# EAGLE schematic mainboard.pa1 (EAGLE 4.11)
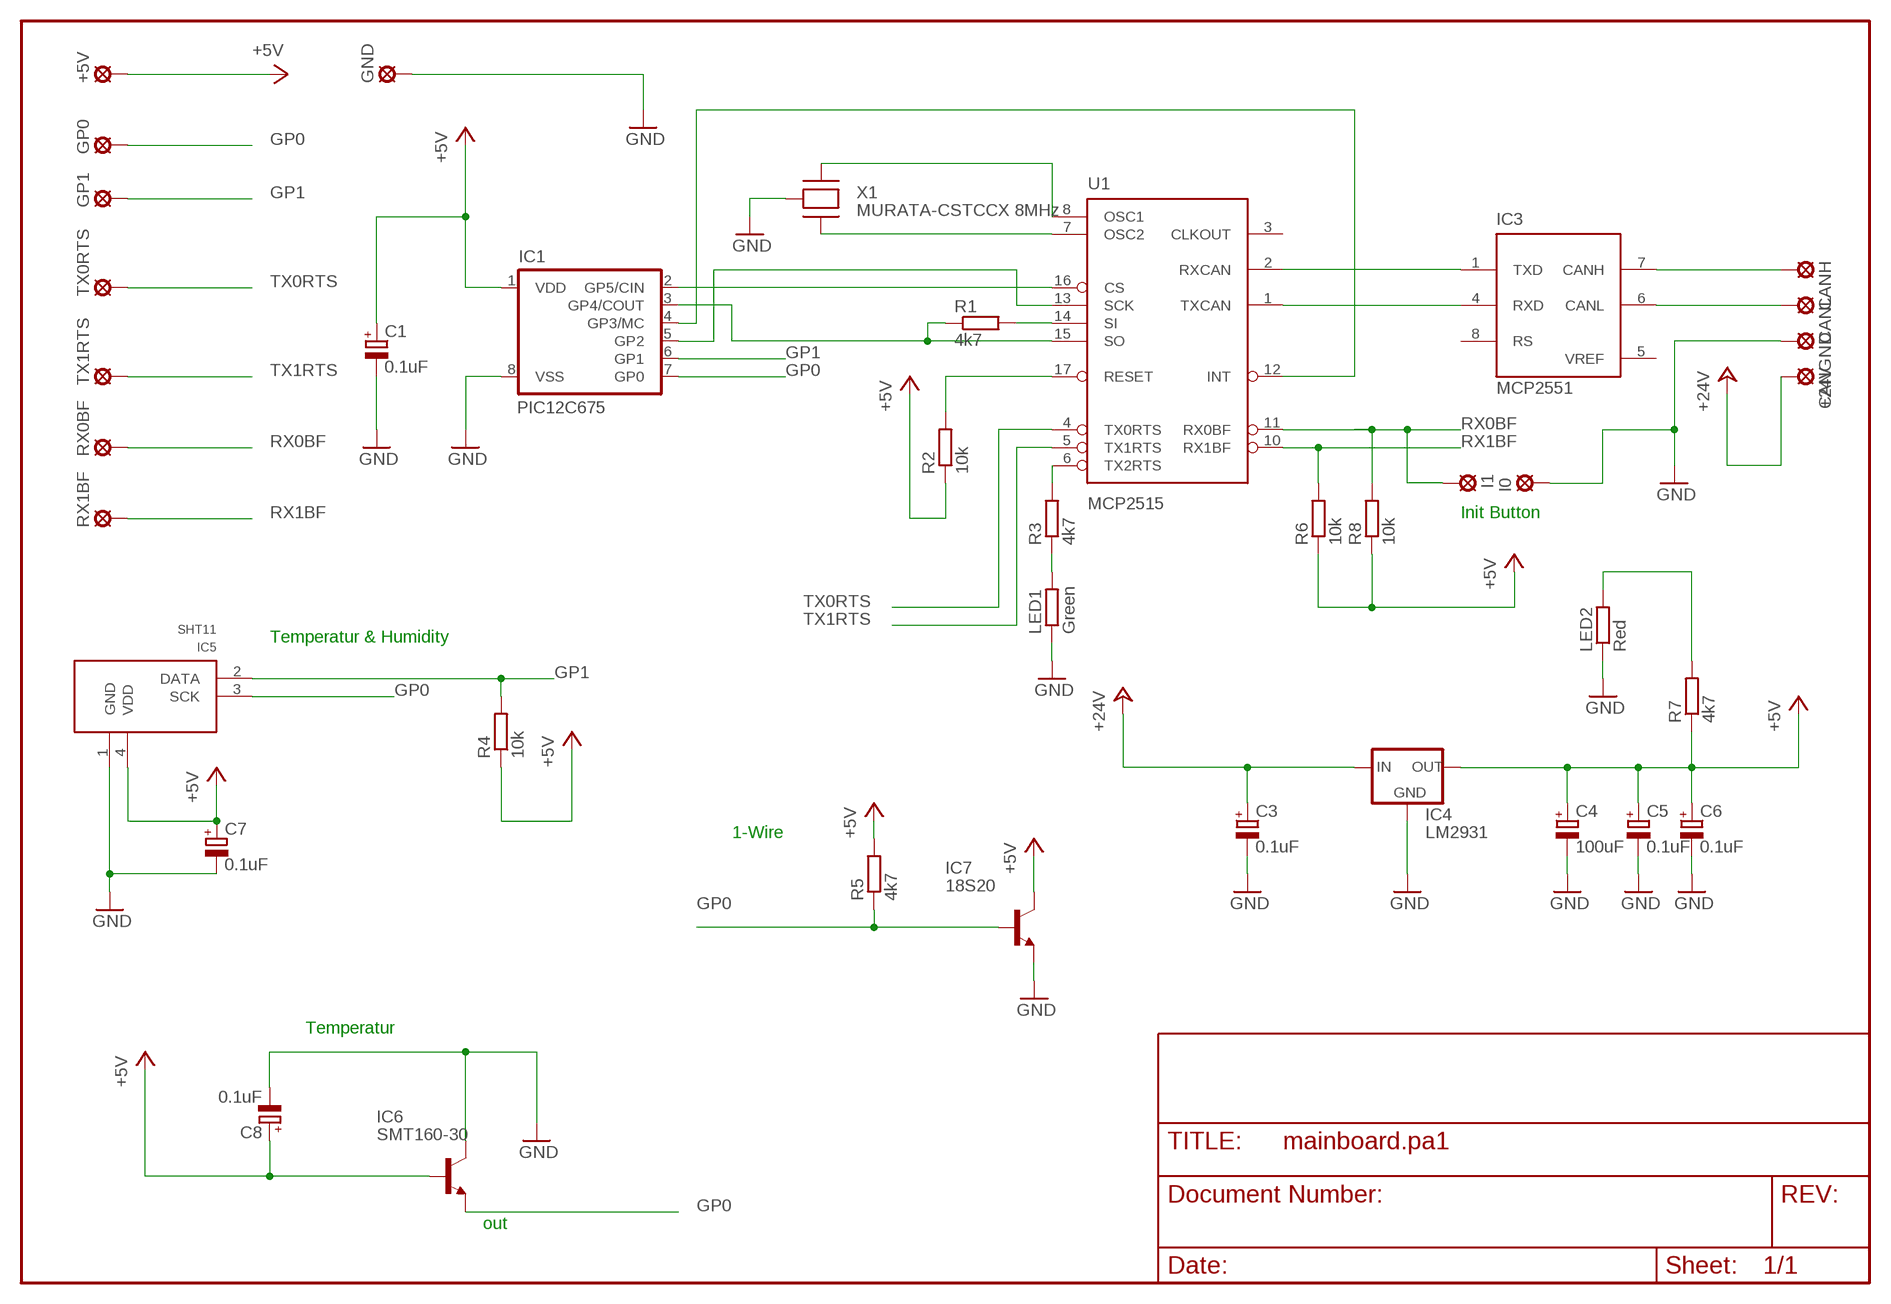
[diagram p0: schematic, sheet 1]

## Parts
+5V  SE14  [SE14]
+24V  SE14  [SE14]
C1  0.1uF  CPOL-EUCT3216  [CT3216]
C3  0.1uF  CPOL-EUCT3216  [CT3216]
C4  100uF  CPOL-EUCT7343  [CT7343]
C5  0.1uF  CPOL-EUCT3216  [CT3216]
C6  0.1uF  CPOL-EUCT3216  [CT3216]
C7  0.1uF  CPOL-EUCT3216  [CT3216]
C8  0.1uF  CPOL-EUCT3216  [CT3216]
CANGND  SE14  [SE14]
CANH  SE14  [SE14]
CANL  SE14  [SE14]
GND  SE14  [SE14]
GP0  SE14  [SE14]
GP1  SE14  [SE14]
I0  SE14  [SE14]
I1  SE14  [SE14]
IC1  PIC12C675  PIC12C672SM  [SO-08M]
IC3  MCP2551  MCP2551SN  [SO-08]
IC4  LM2931  78LXX  [78LXX]
IC5  SHT11  SHT1X  [SHT1X]
IC6  SMT160-30  BC547  [TO92]
IC7  18S20  BC547  [TO92]
LED1  Green  R-EU_R1206  [R1206]
LED2  Red  R-EU_R1206  [R1206]
R1  4k7  R-EU_R0805  [R0805]
R2  10k  R-EU_R0805  [R0805]
R3  4k7  R-EU_R0805  [R0805]
R4  10k  R-EU_R0805  [R0805]
R5  4k7  R-EU_R0805  [R0805]
R6  10k  R-EU_R0805  [R0805]
R7  4k7  R-EU_R0805  [R0805]
R8  10k  R-EU_R0805  [R0805]
RX0BF  SE14  [SE14]
RX1BF  SE14  [SE14]
TX0RTS  SE14  [SE14]
TX1RTS  SE14  [SE14]
U1  MCP2515  MCP2510SO  [SO-18W]
X1  MURATA-CSTCCX 8MHz  MURATA-CSTCCX  [RESONATOR-MURATA-CSTCCX]

## Nets
+5V: +5V.MP C1.+ C4.+ C5.+ C6.+ C7.+ C8.+ IC1.1(VDD) IC4.OUT IC5.4(VDD) IC6.2(B) IC7.3(C) R2.1 R4.1 R5.2 R6.1 R7.1 R8.1
+24V: +24V.MP C3.+ IC4.IN
GND: C1.- C3.- C4.- C5.- C6.- C7.- C8.- CANGND.MP GND.MP I0.MP IC1.8(VSS) IC4.GND IC5.1(GND) IC6.3(C) IC7.1(E) LED1.1 LED2.1 X1.3(GND)
GP0: GP0.MP IC1.7(GP0) IC5.3(SCK) IC6.1(E) IC7.2(B) R5.1
GP1: GP1.MP IC1.6(GP1) IC5.2(DATA) R4.2
GP2: IC1.5(GP2) U1.13(SCK)
GP3: IC1.4(GP3/MC) U1.12(INT)
GP4: IC1.3(GP4/COUT) R1.1 U1.15(SO)
GP5: IC1.2(GP5/CIN) U1.16(CS)
N$1: IC3.1(TXD) U1.2(RXCAN)
N$2: IC3.4(RXD) U1.1(TXCAN)
N$3: R2.2 U1.17(RESET)
N$4: CANH.MP IC3.7(CANH)
N$5: CANL.MP IC3.6(CANL)
N$7: R1.2 U1.14(SI)
N$10: LED1.2 R3.1
N$12: LED2.2 R7.2
OSC1: U1.8(OSC1) X1.2(XTIN)
OSC2: U1.7(OSC2) X1.1(XTOUT)
RX0BF: I1.MP R8.2 RX0BF.MP U1.11(RX0BF)
RX1BF: R6.2 RX1BF.MP U1.10(RX1BF)
TX0RTS: TX0RTS.MP U1.4(TX0RTS)
TX1RTS: TX1RTS.MP U1.5(TX1RTS)
TX2RTS: R3.2 U1.6(TX2RTS)
Unconnected: IC3.8(RS) U1.3(CLKOUT)

## Notes on the sheet
- Init Button
- Temperatur & Humidity
- 1-Wire
- Temperatur
- out

## Power pins joined to a net without a drawn wire
VDD: IC3.3(VDD) U1.18(VDD)
VREF: IC3.5(VREF)
VSS: IC3.2(VSS) U1.9(VSS)

## Library data of the parts
+5V +24V CANGND CANH CANL GND GP0 GP1 I0 I1 RX0BF RX1BF TX0RTS TX1RTS = solpad:SE14: SOLDER PAD E1553, drill 1,4mm, distributor Buerklin, 07F820
C1 C3-C8 = rcl:CPOL-EU: POLARIZED CAPACITOR, European symbol
IC1 = microchip:PIC12C*?: MICROCONTROLLER
IC3 = microchip_can:MCP2551: High Speed CAN tranceiver
IC4 = v-reg:78LXX: VOLTAGE REGULATOR
IC5 = eurosource_ftdi:SHT1X
IC6 IC7 = transistor-npn:BC547*: NPN Transistor
LED1 LED2 R1-R8 = rcl:R-EU_: RESISTOR, European symbol
U1 = microchip_can:MCP2510
X1 = eurosource_ftdi:MURATA-CSTCCX